# Altium schematic sheet Revisions.SchDoc: Heated bed
size A4; CompanyName: Ultimaker B.V.; DrawnBy: Coen de Boer; Engineer: Coen de Boer; Revision: 2.1.2; DocumentName: Heated bed; Rule: PcbType=ProtelPcb
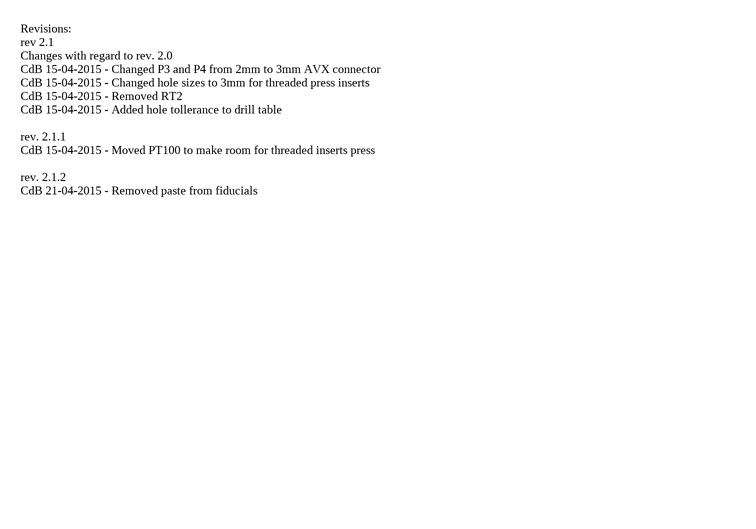
[diagram p0: Revisions.SchDoc]

## Notes on the sheet
- Revisions:
  rev 2.1
  Changes with regard to rev. 2.0
  CdB 15-04-2015 - Changed P3 and P4 from 2mm to 3mm AVX connector
  CdB 15-04-2015 - Changed hole sizes to 3mm for threaded press inserts
  CdB 15-04-2015 - Removed RT2
  CdB 15-04-2015 - Added hole tollerance to drill table
  rev. 2.1.1
  CdB 15-04-2015 - Moved PT100 to make room for threaded inserts press
  rev. 2.1.2
  CdB 21-04-2015 - Removed paste from fiducials
- Title
- Size:
- Date:
- A4
- Number:
- Time:
- Revision:
- Sheet
- of
- File: